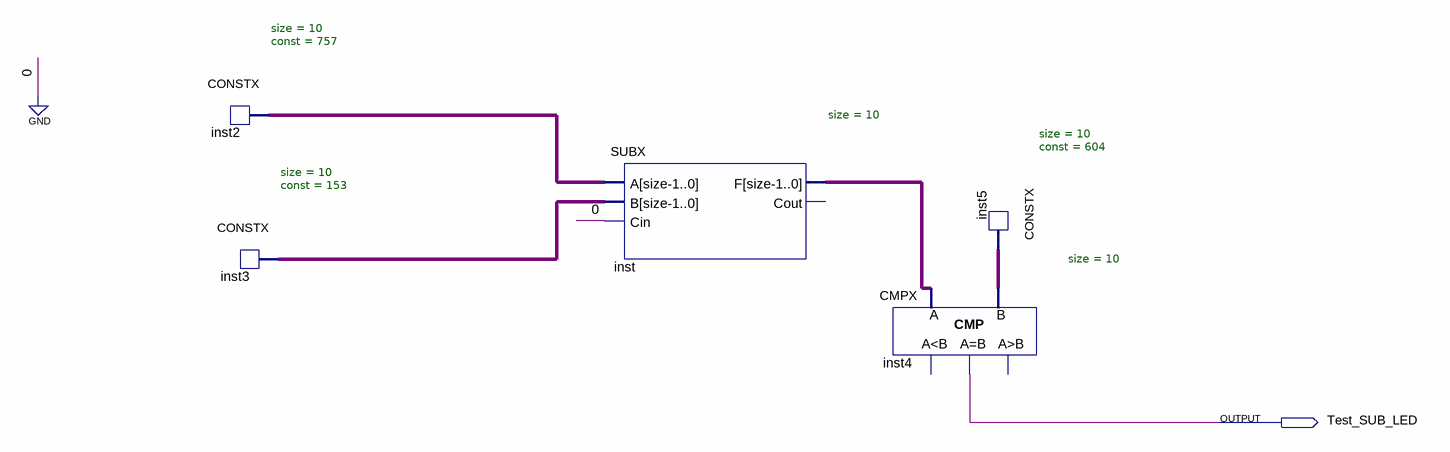
[diagram p0: schematic sheet]
// Quartus schematic Test_SUB.bdf as structural Verilog: 5 symbols, 1 pins
module Test_SUB (
  output Test_SUB_LED
);

  wire [9:0] inst2_data, inst3_data, inst5_data, inst_f;

  CONSTX #(.size(10), .\const (757)) inst2 (.data(inst2_data));
  CONSTX #(.size(10), .\const (153)) inst3 (.data(inst3_data));
  SUBX #(.size(10)) inst (.A(inst2_data), .B(inst3_data), .Cin(1'b0), .F(inst_f));  // open: Cout
  CMPX #(.size(10)) inst4 (.A(inst_f), .B(inst5_data), .eq(Test_SUB_LED));  // open: ls, gr
  CONSTX #(.size(10), .\const (604)) inst5 (.data(inst5_data));
endmodule
